# EasyEDA schematic 1-Schematic_BATTERY_ELIMINATOR.json
TITLE: Sheet_1; REV: 1.0; Date: 2025-09-19; Sheet: 1/1; Drawn By: shyam_elec; Company: Your Company
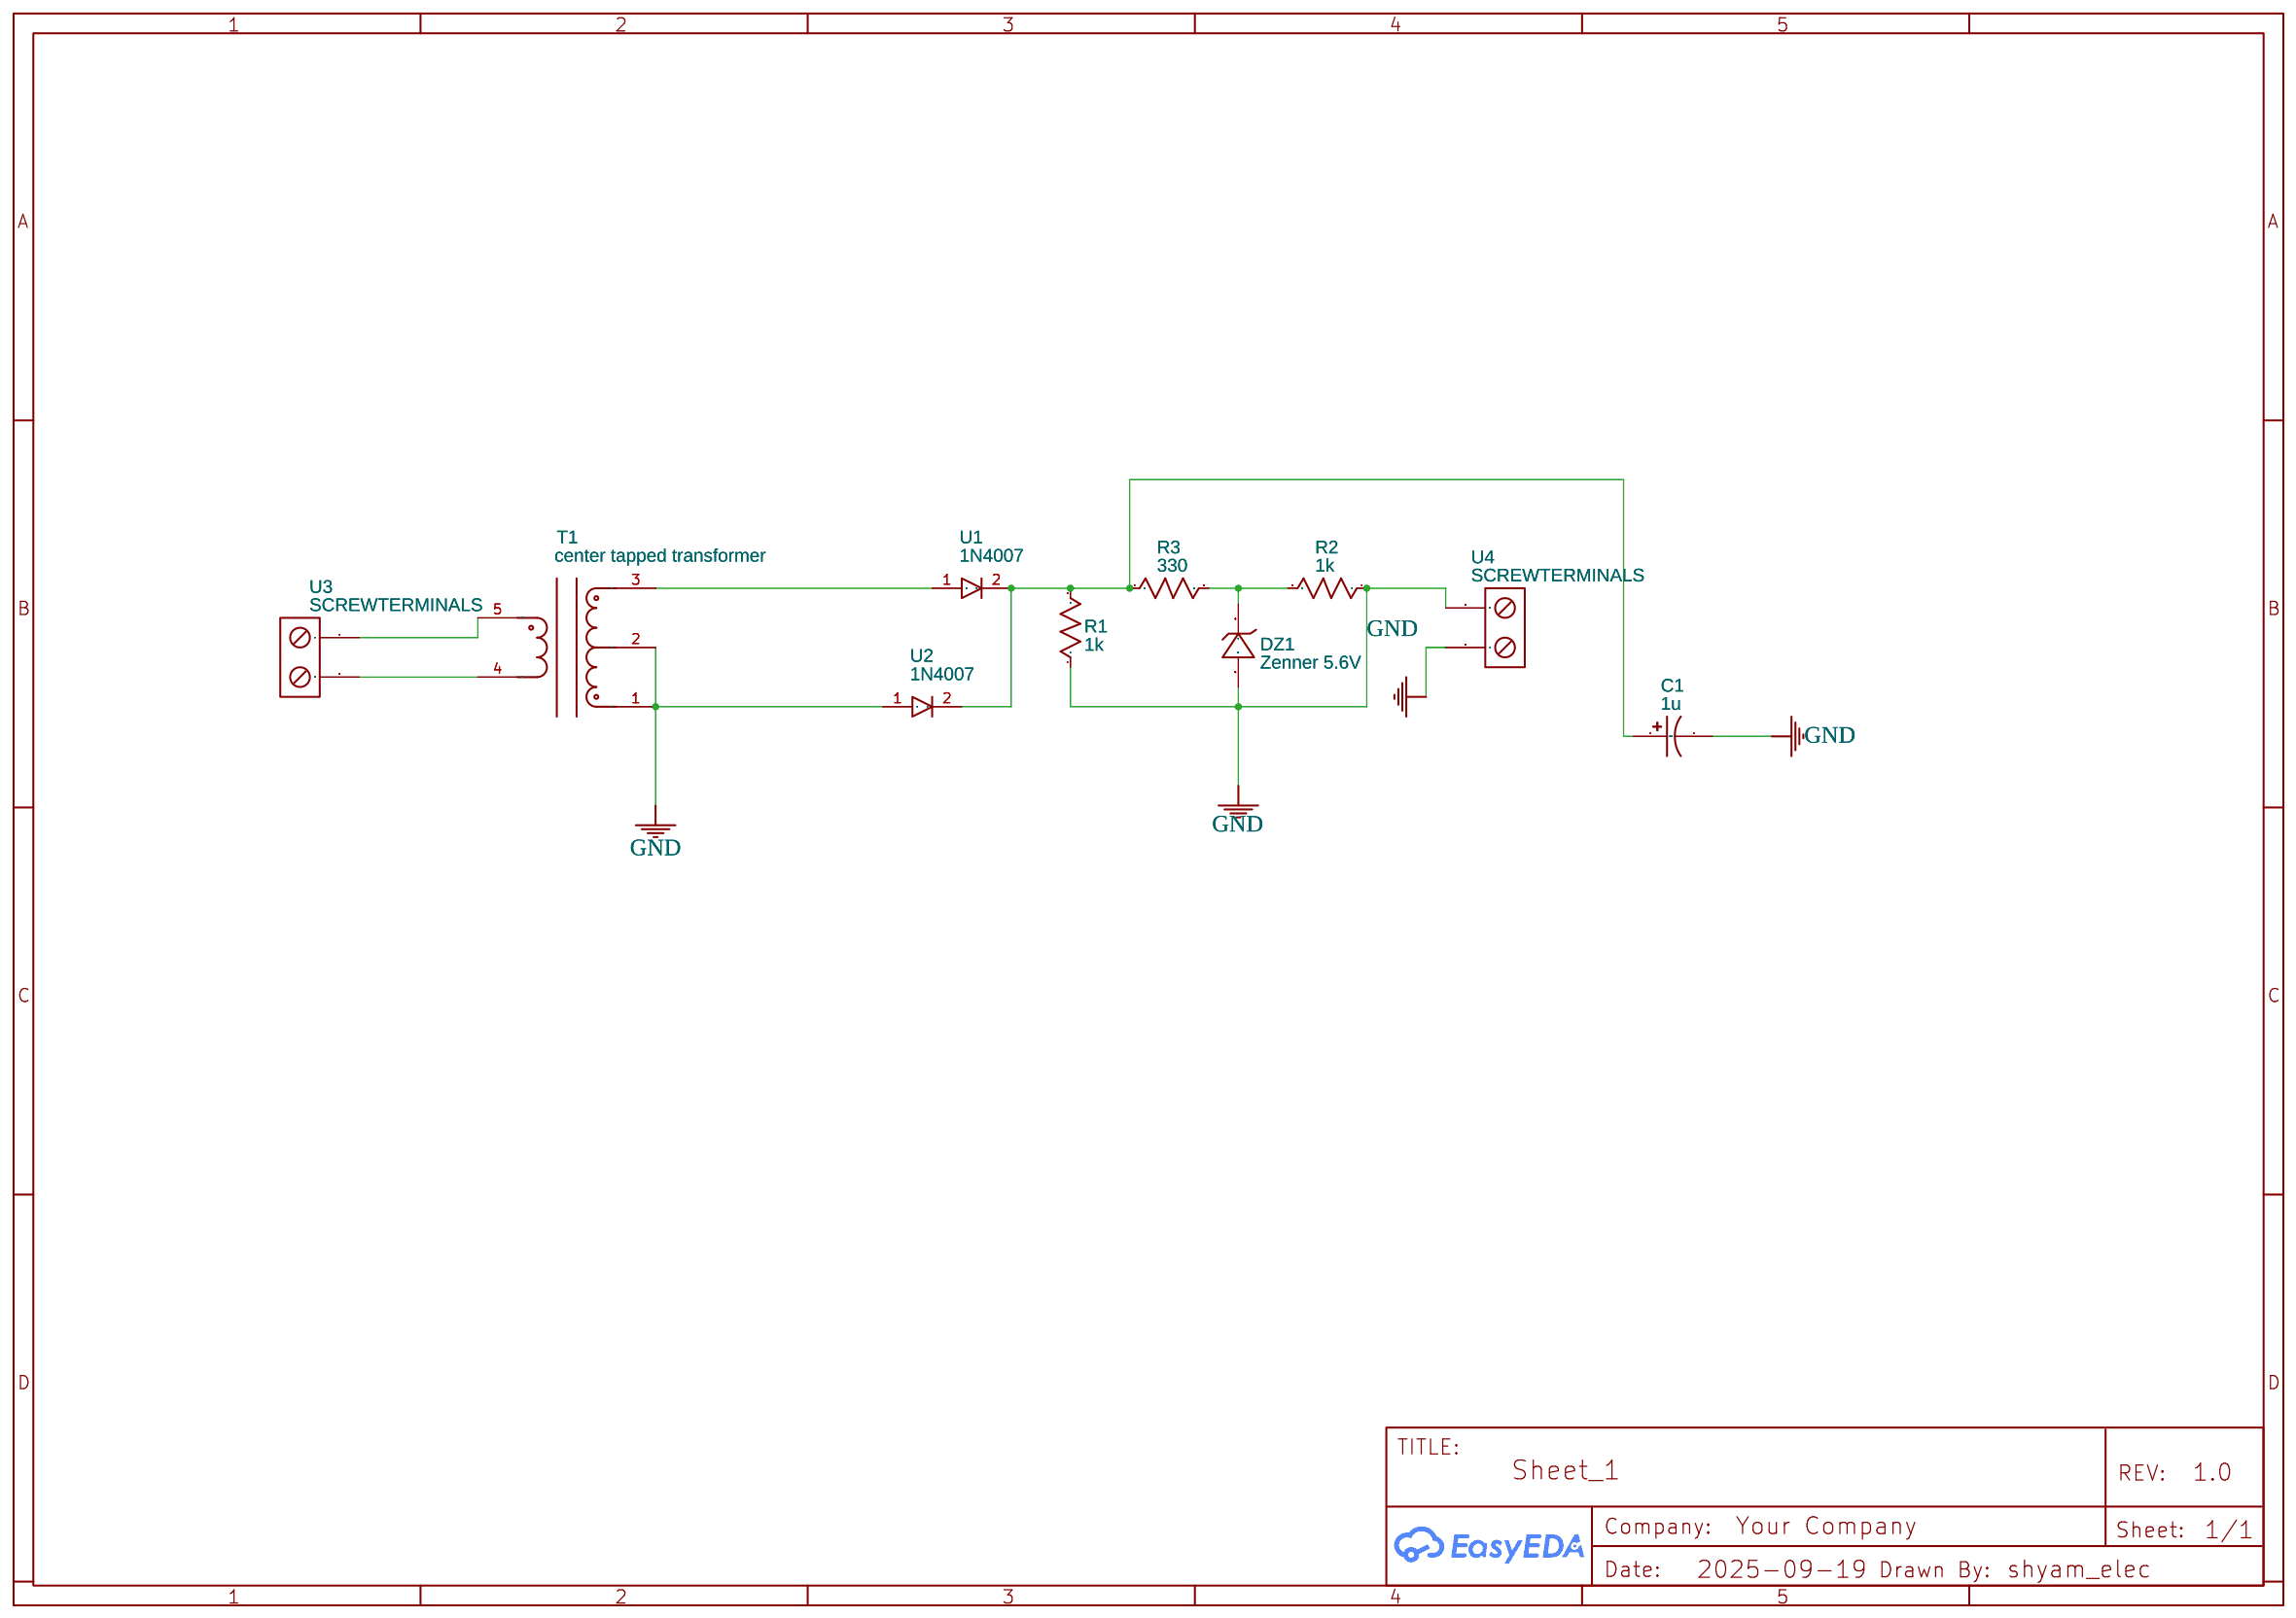
[diagram p0: schematic sheet]

## Parts
C1  1u  [CAP-D12.5×F5.0]
DZ1  Zenner 5.6V  [DIODE-ZENER]
R1  1k  [R_AXIAL-0.5]
R2  1k  [R_AXIAL-0.5]
R3  330  [R_AXIAL-0.5]
T1  center tapped transformer  [CENTER TAPPED TRANSFORMER]
U1  1N4007  [1N4007]
U2  1N4007  [1N4007]
U3  SCREWTERMINALS  [SCREW_TERMINALS 2X]
U4  SCREWTERMINALS  [SCREW_TERMINALS 2X]

## Library data of the parts
C1 = CE_TH_D12.5×F5.0_US: Contributor: LCEDA_Lib
DZ1 = Zenner 5.6V: Contributor: microdroid2023
R1-R3 = R_AXIAL-0.5_US: Contributor: LCEDA_Lib
T1 = center tapped transformer: Supplier: LCSC; Manufacturer: HANRUN; Manufacturer Part: HR051142; Supplier Part: C55680; Contributor: 727823tuec027
U1 U2 = 1N4007: Contributor: steklopak13
U3 U4 = SCREWTERMINALS: Contributor: Gereon99

## Nets
GND: C1.2 DZ1.P$2(2) R1.1 R2.1 T1.1 T1.2 U2.1 U4.1 U4.2
Net-(C1-1): C1.1 R1.2 R3.1 U1.2 U2.2
Net-(DZ1-P$1): DZ1.P$1(1) R2.2 R3.2
Net-(T1-3): T1.3 U1.1
Net-(T1-4): T1.4 U3.2
Net-(T1-5): T1.5 U3.1
